# Altium schematic sheet _i2c0.SchDoc
size Tabloid
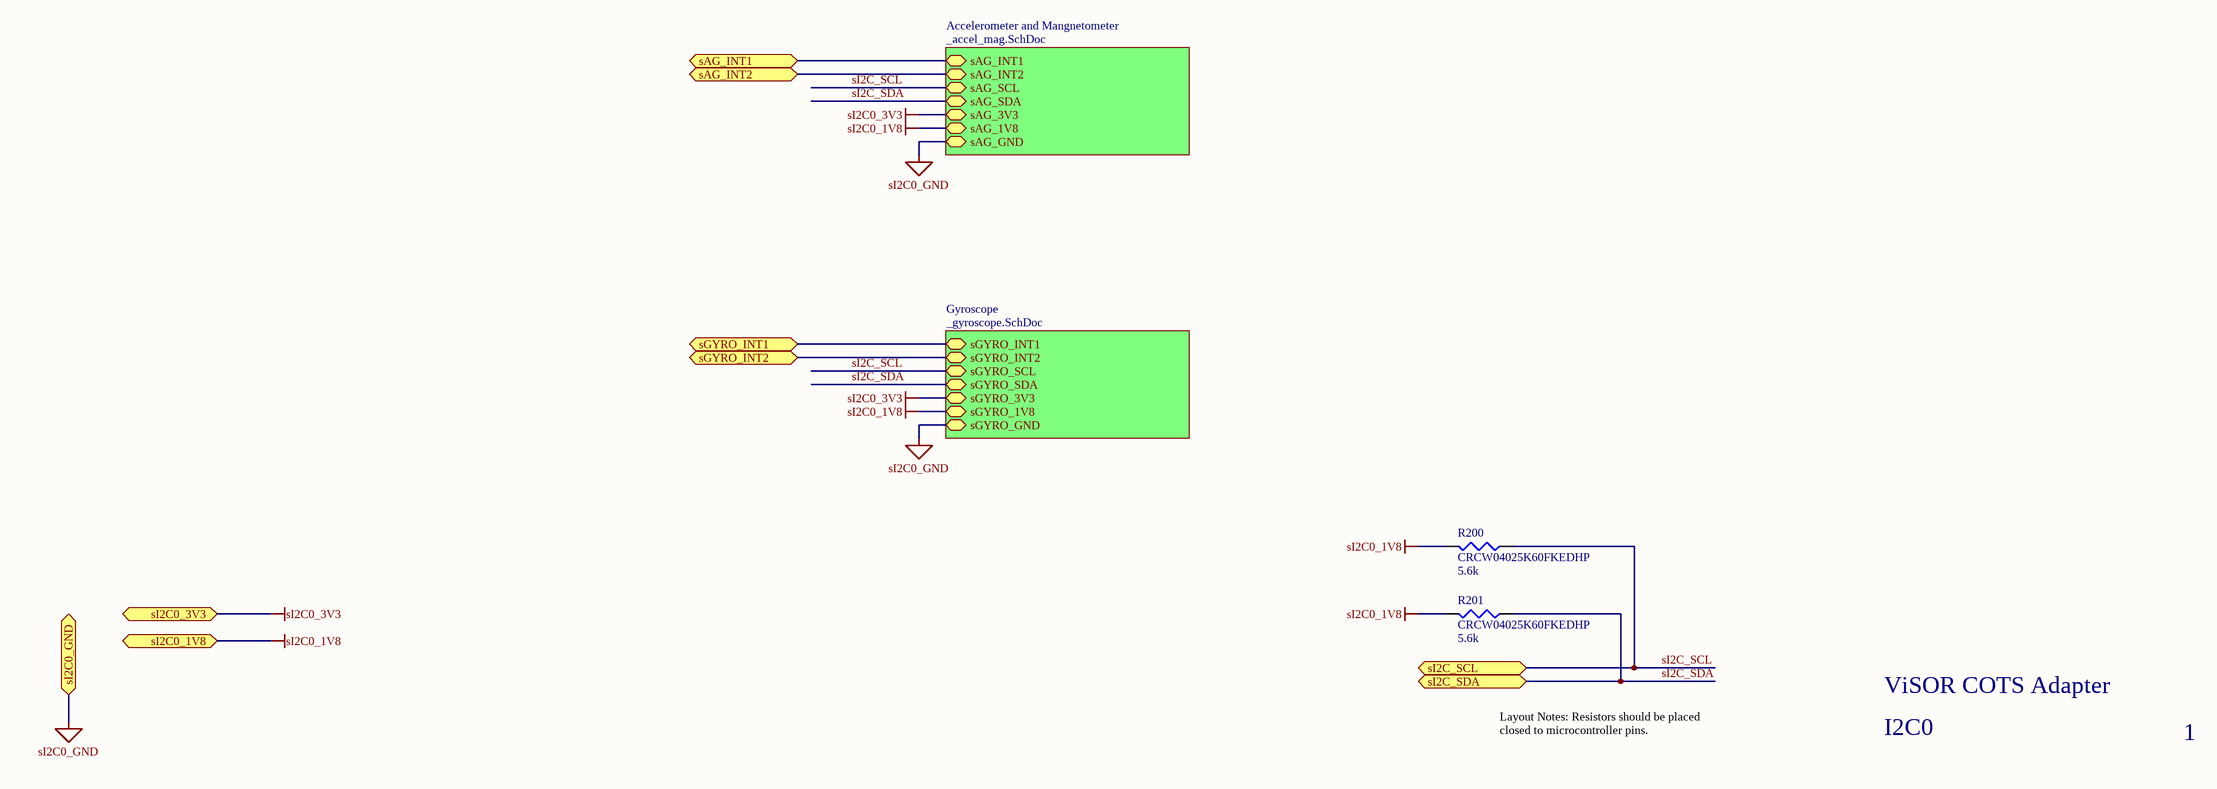
[diagram p0: _i2c0.SchDoc]

## Parts
R200  CRCW04025K60FKEDHP  value 5.6k  [0402]
R201  CRCW04025K60FKEDHP  value 5.6k  [0402]

## Sub-sheets
Accelerometer and Mangnetometer = _accel_mag.SchDoc: sAG_3V3, sAG_GND, sAG_SCL, sAG_SDA, sAG_INT1, sAG_INT2, sAG_1V8
Gyroscope = _gyroscope.SchDoc: sGYRO_3V3, sGYRO_GND, sGYRO_INT1, sGYRO_INT2, sGYRO_SCL, sGYRO_SDA, sGYRO_1V8

## Ports
sAG_INT1, sAG_INT2, sGYRO_INT1, sGYRO_INT2, sI2C0_1V8, sI2C0_3V3, sI2C0_GND, sI2C_SCL, sI2C_SDA

## Nets
sI2C0_1V8: R200.2 R201.2 ; port sI2C0_1V8, sheet Accelerometer and Mangnetometer/sAG_1V8, sheet Gyroscope/sGYRO_1V8
sI2C0_3V3: port sI2C0_3V3, sheet Accelerometer and Mangnetometer/sAG_3V3, sheet Gyroscope/sGYRO_3V3
sI2C0_GND: port sI2C0_GND, sheet Accelerometer and Mangnetometer/sAG_GND, sheet Gyroscope/sGYRO_GND
sAG_INT1: port sAG_INT1, sheet Accelerometer and Mangnetometer/sAG_INT1
sAG_INT2: port sAG_INT2, sheet Accelerometer and Mangnetometer/sAG_INT2
sGYRO_INT1: port sGYRO_INT1, sheet Gyroscope/sGYRO_INT1
sGYRO_INT2: port sGYRO_INT2, sheet Gyroscope/sGYRO_INT2
sI2C_SCL: R200.1 ; port sI2C_SCL, sheet Accelerometer and Mangnetometer/sAG_SCL, sheet Gyroscope/sGYRO_SCL
sI2C_SDA: R201.1 ; port sI2C_SDA, sheet Accelerometer and Mangnetometer/sAG_SDA, sheet Gyroscope/sGYRO_SDA

## Notes on the sheet
- ViSOR COTS Adapter
- Layout Notes: Resistors should be placed closed to microcontroller pins.
- I2C0
- 1

## Library data of the parts
R200 R201 = CRCW0402xxxxFKED: 0.125W, -55-155C, 1005, 50V, ±1%